# Altium schematic sheet OP_AMP_Single&double.SchDoc
size A4; Author: Yaokun/Felix Zhang; Organization: Altium Limited; Address1: 21A144; Address2: Harbin Engineering University; Address3: Harbin; Address4: CHINA
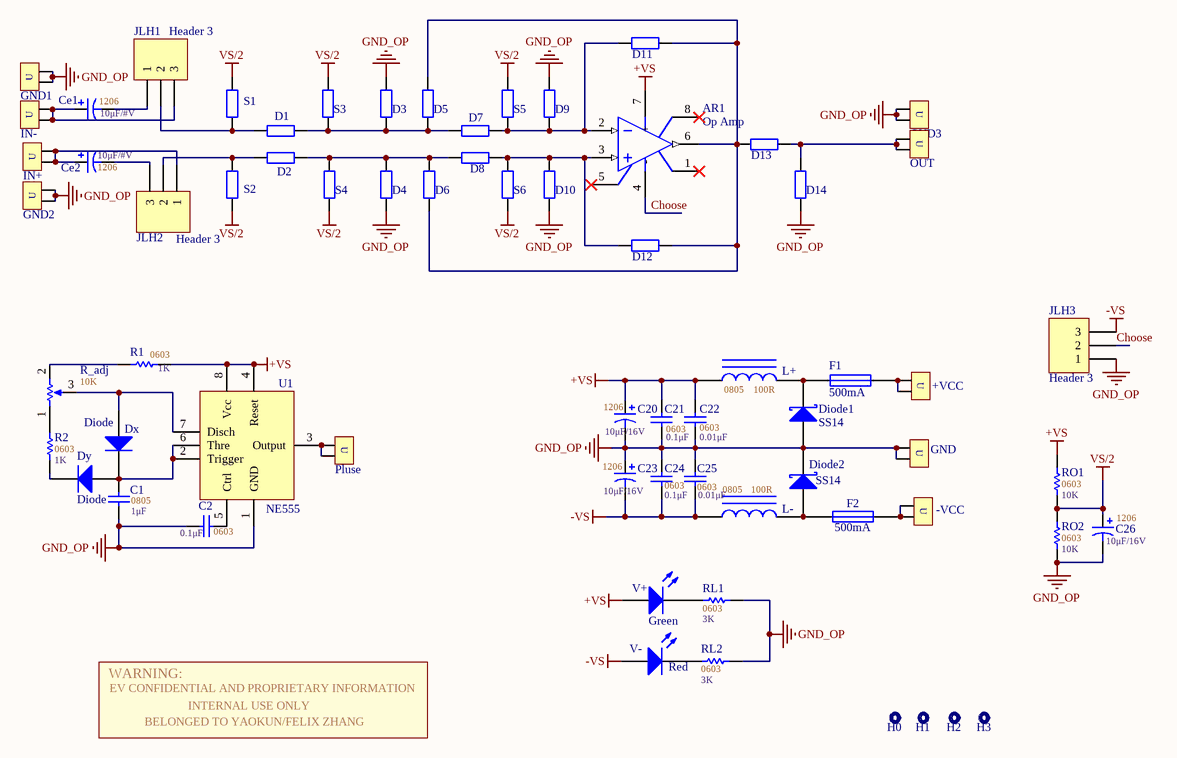
[diagram p0: OP_AMP_Single&double.SchDoc]

## Parts
*  LOGO_Felix  [ALI_Logo_S]  (value not drawn)
+VCC  U HDR  [Header_U_1]  (value not drawn)
-VCC  U HDR  [Header_U_1]  (value not drawn)
AR1  Op Amp  [Sop8_double]
C1  value 1μF  PackageReference: 0805  [CAP_0805_20*12]  (hidden comment: 0603)
C2  value 0.1μF  [CAP_0603_16*08]  (hidden comment: 0603)
C20  value 10μF/16V  PackageReference: 1206  [CAP_1206]  (hidden comment: Polar)
C21  value 0.1μF  [CAP_0603_16*08]  (hidden comment: 0603)
C22  value 0.01μF  [CAP_0603_16*08]  (hidden comment: 0603)
C23  value 10μF/16V  PackageReference: 1206  [CAP_1206]  (hidden comment: Polar)
C24  value 0.1μF  [CAP_0603_16*08]  (hidden comment: 0603)
C25  value 0.01μF  [CAP_0603_16*08]  (hidden comment: 0603)
C26  value 10μF/16V  PackageReference: 1206  [CAP_1206]  (hidden comment: Polar)
Ce1  value 10μF/#V  PackageReference: 1206  [CAP_1206]  (hidden comment: Polar)
Ce2  value 10μF/#V  PackageReference: 1206  [CAP_1206]  (hidden comment: Polar)
D1  RES_Thru-hole  [PAD_RES]  (value not drawn)
D2  RES_Thru-hole  [PAD_RES]  (value not drawn)
D3  RES_Thru-hole  [PAD_RES]  (value not drawn)
D4  RES_Thru-hole  [PAD_RES]  (value not drawn)
D5  RES_Thru-hole  [PAD_RES]  (value not drawn)
D6  RES_Thru-hole  [PAD_RES]  (value not drawn)
D7  RES_Thru-hole  [PAD_RES]  (value not drawn)
D8  RES_Thru-hole  [PAD_RES]  (value not drawn)
D9  RES_Thru-hole  [PAD_RES]  (value not drawn)
D10  RES_Thru-hole  [PAD_RES]  (value not drawn)
D11  RES_Thru-hole  [PAD_RES]  (value not drawn)
D12  RES_Thru-hole  [PAD_RES]  (value not drawn)
D13  RES_Thru-hole  [PAD_RES]  (value not drawn)
D14  RES_Thru-hole  [PAD_RES]  (value not drawn)
Diode1  SS14  [SMA]
Diode2  SS14  [SMA]
Dx  Diode  [Diode1206]
Dy  Diode  [Diode1206]
F1  500mA  [RES_0805_20*12]
F2  500mA  [RES_0805_20*12]
GND  U HDR  [Header_U_1]  (value not drawn)
GND1  U HDR  [Header_U_1]  (value not drawn)
GND2  U HDR  [Header_U_1]  (value not drawn)
GND3  U HDR  [Header_U_1]  (value not drawn)
H0  Pad3mm  [PAD]  (value not drawn)
H1  Pad3mm  [PAD]  (value not drawn)
H2  Pad3mm  [PAD]  (value not drawn)
H3  Pad3mm  [PAD]  (value not drawn)
IN+  U HDR  [Header_U_1]  (value not drawn)
IN-  U HDR  [Header_U_1]  (value not drawn)
JLH1  Header 3  [HEADER1*3_PIN]
JLH2  Header 3  [HEADER1*3_PIN]
JLH3  Header 3  [HEADER1*3_PIN]
L+  value 100R  PackageDescription: 0805  [IND_0805_20*12]  (hidden comment: Inductor Iron)
L-  value 100R  PackageDescription: 0805  [IND_0805_20*12]  (hidden comment: Inductor Iron)
OUT  U HDR  [Header_U_1]  (value not drawn)
Pluse  U HDR  [Header_U_1]  (value not drawn)
R1  value 1K  PackageReference: 0603  [RES_0805_20*12]  (hidden comment: SMD)
R2  value 1K  PackageReference: 0603  [RES_0805_20*12]  (hidden comment: SMD)
R_adj  value 10K  [RES_ADJ_h]  (hidden comment: RES_ADJ)
RL1  value 3K  PackageReference: 0603  [RES_0805_20*12]  (hidden comment: SMD)
RL2  value 3K  PackageReference: 0603  [RES_0805_20*12]  (hidden comment: SMD)
RO1  value 10K  PackageReference: 0603  [RES_0805_20*12]  (hidden comment: SMD)
RO2  value 10K  PackageReference: 0603  [RES_0805_20*12]  (hidden comment: SMD)
S1  RES_Thru-hole  [PAD_RES]  (value not drawn)
S2  RES_Thru-hole  [PAD_RES]  (value not drawn)
S3  RES_Thru-hole  [PAD_RES]  (value not drawn)
S4  RES_Thru-hole  [PAD_RES]  (value not drawn)
S5  RES_Thru-hole  [PAD_RES]  (value not drawn)
S6  RES_Thru-hole  [PAD_RES]  (value not drawn)
U1  NE555  [SO8_M]
V+  Green  [LED_0805]
V-  Red  [LED_0805]

## Nets
+VS: AR1.7(+) C20.1 C21.2 C22.2 L+.1 R1.2 RO1.2 U1.4(Reset) U1.8(Vcc) V+.1(A)
-VS: C23.2 C24.1 C25.1 JLH3.3 L-.1 V-.1(A)
GND_OP: C1.1 C2.2 C20.2 C21.1 C22.1 C23.1 C24.2 C25.2 C26.2 D3.2 D4.1 D9.2 D10.1 D14.1 Diode1.1(A) Diode2.2(K) GND.1 GND.2 GND1.1 GND1.2 GND2.1 GND2.2 GND3.1 GND3.2 JLH3.1 RL1.2 RL2.2 RO2.1 U1.1(GND)
VS/2: C26.1 RO1.1 RO2.2 S1.2 S2.1 S3.2 S4.1 S5.2 S6.1
Choose: AR1.4(-) JLH3.2
Net+VCC_1: +VCC.1 +VCC.2 F1.2
Net-VCC_1: -VCC.1 -VCC.2 F2.2
NetAR1_2: AR1.2(IN-) D7.2 D9.1 D11.1 S5.1
NetAR1_3: AR1.3(IN+) D8.2 D10.2 D12.1 S6.2
NetAR1_6: AR1.6(OUT) D5.2 D6.1 D11.2 D12.2 D13.1
NetC1_2: C1.2 Dx.2(K) Dy.1(A) U1.2(Trigger) U1.6(Thre)
NetC2_1: C2.1 U1.5(Ctrl)
NetCe1_1: Ce1.1 IN-.1 IN-.2 JLH1.3
NetCe1_2: Ce1.2 JLH1.1
NetCe2_1: Ce2.1 IN+.1 IN+.2 JLH2.1
NetCe2_2: Ce2.2 JLH2.3
NetD1_1: D1.1 JLH1.2 S1.1
NetD1_2: D1.2 D3.1 D5.1 D7.1 S3.1
NetD2_1: D2.1 JLH2.2 S2.2
NetD2_2: D2.2 D4.2 D6.2 D8.1 S4.2
NetD13_2: D13.2 D14.2 OUT.1 OUT.2
NetDiode1_2: Diode1.2(K) F1.1 L+.2
NetDiode2_1: Diode2.1(A) F2.1 L-.2
NetDx_1: Dx.1(A) R_adj.3(TAP) U1.7(Disch)
NetDy_2: Dy.2(K) R2.1
NetPluse_1: Pluse.1 Pluse.2 U1.3(Output)
NetR1_1: R1.1 R_adj.2(BOT)
NetR2_2: R2.2 R_adj.1(TOP)
NetRL1_1: RL1.1 V+.2(K)
NetRL2_1: RL2.1 V-.2(K)

Not connected (* = marked no-connect by the designer): AR1 1(OS_NUL)* 5(OS_NUL)* 8(TAB)*

## Notes on the sheet
- Title
- Size:
- Date:
- A4
- Number:
- Time:
- Revision:
- Sheet
- of
- Author:
- File:
- (in symbol Header_U) U
- (in symbol LOGO_Felix) WARNING:; EV CONFIDENTIAL AND PROPRIETARY INFORMATION; INTERNAL USE ONLY; BELONGED TO YAOKUN/FELIX ZHANG

## Library data of the parts
* = LOGO_Felix: My Logo
+VCC -VCC GND GND1-GND3 IN+ IN- OUT Pluse = Header_U
AR1 = Op Amp: FET Operational Amplifier; Published: 8-Jun-2000; LatestRevisionDate: 17-Jul-2002; LatestRevisionNote: Re-released for DXP Platform.; DatasheetVersion: REV. B; PackageVersion: 1990; PackageReference: H-08A; Publisher: Altium Limited; PackageDescription: Can; 8 Leads; Pin Circle Dia. 5.08 mm; Lead Dia. 0.53 mm (max); ComponentLink1Description: Manufacturer Link; ComponentLink1URL: http://www.analog.com/
C1 C2 C21 C22 C24 C25 = Cap: Capacitor; Published: 8-Jun-2000; LatestRevisionDate: 17-Jul-2002; LatestRevisionNote: Re-released for DXP Platform.; Publisher: Altium Limited; PackageDescription: 0603
  C2 C21 C22 C24 C25: PackageReference: 0603
C20 C23 C26 Ce1 Ce2 = Cap Pol: Polarized Capacitor (Axial); LatestRevisionDate: 17-Jul-2002; LatestRevisionNote: Re-released for DXP Platform.; Publisher: Altium Limited; Published: 1206; PackageDescription: Polar
D1-D14 S1-S6 = RES_Thru-hole: Resistor; Value: 1K; Published: 8-Jun-2000; LatestRevisionDate: 17-Jul-2002; LatestRevisionNote: Re-released for DXP Platform.; PackageReference: AXIAL-0.4; Publisher: Altium Limited; PackageDescription: Axial Device, Thru-Hole; 2 Leads; 0.4 in Pin Spacing
Diode1 Diode2 = D Schottky: Schottky Diode; Published: 8-Jun-2000; LatestRevisionDate: 17-Jul-2002; LatestRevisionNote: Re-released for DXP Platform.; PackageReference: SMB; Publisher: Altium Limited; PackageDescription: DO-214-AA/SMB; 2 C-Bend Leads; Body 5.3 x 3.6 mm, inc. leads (LxW); Code_JEDEC: DO-214-AA
Dx Dy = Diode: Default Diode; Published: 8-Jun-2000; LatestRevisionDate: 17-Jul-2002; LatestRevisionNote: Re-released for DXP Platform.; PackageVersion: Sep-1996; PackageReference: SMC; Publisher: Altium Limited; PackageDescription: DO-214-AB/SMC; 2 C-Bend Leads; Body 7.9 x 5.9 mm, inc. leads (LxW); Code_JEDEC: DO-214-AB
F1 F2 = Fuse 1: Fuse; Published: 8-Jun-2000; LatestRevisionDate: 17-Jul-2002; LatestRevisionNote: Re-released for DXP Platform.; PackageReference: PIN-W2/E2.8; Publisher: Altium Limited; PackageDescription: Thru-Hole; 2 Leads
JLH1-JLH3 = Header 3: Header, 3-Pin; LatestRevisionDate: 17-Jul-2002; LatestRevisionNote: Re-released for DXP Platform.; Publisher: Altium Limited
L+ L- = Inductor Iron: Magnetic-Core Inductor; Published: 24-Mar-1999; LatestRevisionDate: 17-Jul-2002; LatestRevisionNote: Re-released for DXP Platform.; PackageReference: AXIAL-0.9; Publisher: Altium Limited
R1 R2 RL1 RL2 RO1 RO2 = RES_SMD: Resistor; Published: 8-Jun-2000; LatestRevisionDate: 17-Jul-2002; LatestRevisionNote: Re-released for DXP Platform.; Publisher: Altium Limited; PackageDescription: SMD
R_adj = RES_ADJ: Potentiometer; Sim Note: Enter the Resistance value and the set point into parameter fields.; Set Position: 0.5; Published: 8-Jun-2000; LatestRevisionDate: 17-Jul-2002; LatestRevisionNote: Re-released for DXP Platform.; PackageReference: VR5; Publisher: Altium Limited; PackageDescription: Variable Resistor, Thru-Hole; 3 Leads
V+ V- = LED: Typical RED, GREEN, YELLOW, AMBER GaAs LED; Published: 8-Jun-2000; LatestRevisionDate: 17-Jul-2002; LatestRevisionNote: Re-released for DXP Platform.; PackageVersion: Feb-2002; PackageReference: 3.2X1.6X1.1; Publisher: Altium Limited; PackageDescription: SM LED; 2 Flat Leads